# EAGLE design LOCO-WIFI (EAGLE 9.5.2)
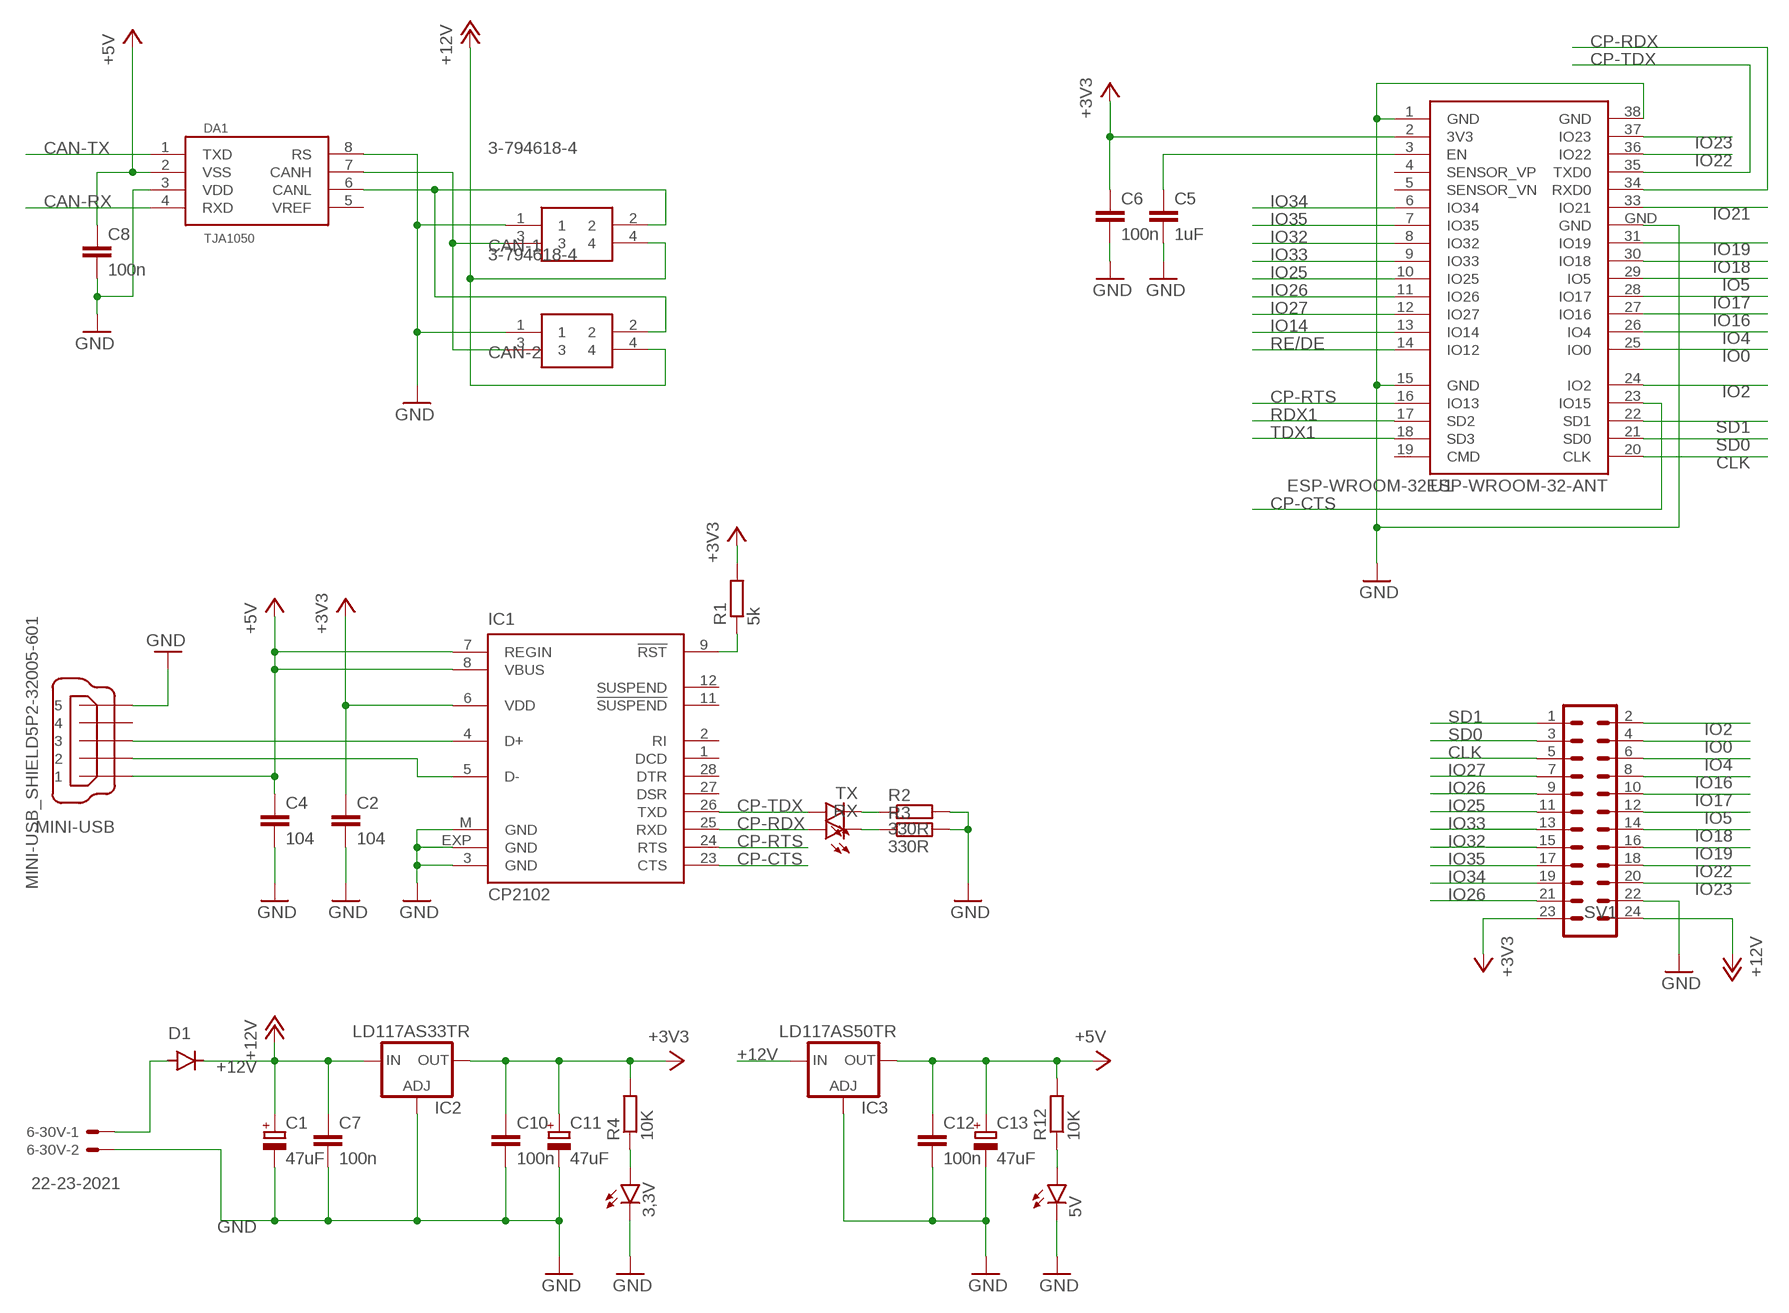
[diagram p0: schematic, sheet 1]

## Parts
3,3V  LEDCHIPLED_0603  [CHIPLED_0603]
5V  LEDCHIPLED_0603  [CHIPLED_0603]
6-30V  22-23-2021  [22-23-2021]
C1  47uF  CPOL-EUB/3528-21R  [B/3528-21R]
C2  104  C-EUC0402  [C0402]
C4  104  C-EUC0402  [C0402]
C5  1uF  C-EUC0402  [C0402]
C6  100n  C-EUC0402  [C0402]
C7  100n  C-EUC0402  [C0402]
C8  100n  C-EUC0402  [C0402]
C10  100n  C-EUC0402  [C0402]
C11  47uF  CPOL-EUB/3528-21R  [B/3528-21R]
C12  100n  C-EUC0402  [C0402]
C13  47uF  CPOL-EUB/3528-21R  [B/3528-21R]
CAN-1  3-794618-4  [SHDRRA4W102P300_2X2_686X892X73]
CAN-2  3-794618-4  [SHDRRA4W102P300_2X2_686X892X73]
D1  DIODE-DO-214AC  [DO-214AC]
DA1  TJA1050  [SO08]
IC1  CP2102  [MLP28]
IC2  LD117AS33TR  [SOT223]
IC3  LD117AS50TR  [SOT223]
MINI-USB  MINI-USB_SHIELD5P2-32005-601  [32005-601]
R1  5k  R-EU_R0603  [R0603]
R2  330R  R-EU_R0603  [R0603]
R3  330R  R-EU_R0603  [R0603]
R4  10K  R-EU_R0603  [R0603]
R12  10K  R-EU_R0603  [R0603]
RX  LEDCHIPLED_0603  [CHIPLED_0603]
SV1  MA12-2  [MA12-2]
TX  LEDCHIPLED_0603  [CHIPLED_0603]
U1  ESP-WROOM-32ESP-WROOM-32-ANT  [ESP-WROOM-32-ANT]

## Nets
+3V3: C2.1 C6.1 C10.1 C11.+ IC1.6(VDD) IC2.4(OUT) R1.2 R4.2 SV1.23 U1.2(3V3)
+5V: C4.1 C8.1 C12.1 C13.+ DA1.2(VSS) IC1.7(REGIN) IC1.8(VBUS) IC3.4(OUT) MINI-USB.1 R12.2
+12V: C1.+ C7.1 CAN-1.4 CAN-2.4 D1.C IC2.3(IN) IC3.3(IN) SV1.24
CAN-RX: DA1.4(RXD)
CAN-TX: DA1.1(TXD)
CLK: SV1.5 U1.20(CLK)
CP-CTS: IC1.23(CTS) U1.23(IO15)
CP-RDX: IC1.25(RXD) RX.A U1.34(RXD0)
CP-RTS: IC1.24(RTS) U1.16(IO13)
CP-TDX: IC1.26(TXD) TX.A U1.35(TXD0)
GND: 3,3V.C 5V.C 6-30V.2 C1.- C2.2 C4.2 C5.2 C6.2 C7.2 C8.2 C10.2 C11.- C12.2 C13.- CAN-1.1 CAN-2.1 DA1.3(VDD) DA1.8(RS) IC1.3(GND) IC1.EXP(GND) IC1.M(GND) IC2.1(ADJ) IC3.1(ADJ) MINI-USB.5 R2.2 R3.2 SV1.22 U1.1(GND) U1.15(GND) U1.38(GND) U1.GND
IO0: SV1.4 U1.25(IO0)
IO2: SV1.2 U1.24(IO2)
IO4: SV1.6 U1.26(IO4)
IO5: SV1.12 U1.29(IO5)
IO14: U1.13(IO14)
IO16: SV1.8 U1.27(IO16)
IO17: SV1.10 U1.28(IO17)
IO18: SV1.14 U1.30(IO18)
IO19: SV1.16 U1.31(IO19)
IO21: U1.33(IO21)
IO22: SV1.18 U1.36(IO22)
IO23: SV1.20 U1.37(IO23)
IO25: SV1.11 U1.10(IO25)
IO26: SV1.9 SV1.21 U1.11(IO26)
IO27: SV1.7 U1.12(IO27)
IO32: SV1.15 U1.8(IO32)
IO33: SV1.13 U1.9(IO33)
IO34: SV1.19 U1.6(IO34)
IO35: SV1.17 U1.7(IO35)
N$1: IC1.5(D-) MINI-USB.2
N$2: IC1.4(D+) MINI-USB.3
N$3: IC1.9(!RST) R1.1
N$4: 6-30V.1 D1.A
N$5: R2.1 TX.C
N$6: 3,3V.A R4.1
N$7: R3.1 RX.C
N$8: CAN-1.3 CAN-2.3 DA1.7(CANH)
N$9: CAN-1.2 CAN-2.2 DA1.6(CANL)
N$13: 5V.A R12.1
RDX1: U1.17(SD2)
RE/DE: U1.14(IO12)
RESET: C5.1 U1.3(EN)
SD0: SV1.3 U1.21(SD0)
SD1: SV1.1 U1.22(SD1)
TDX1: U1.18(SD3)
Unconnected: DA1.5(VREF) IC1.1(DCD) IC1.2(RI) IC1.11(!SUSPEND) IC1.12(SUSPEND) IC1.27(DSR) IC1.28(DTR) MINI-USB.4 MINI-USB.M1(S1) MINI-USB.M2(S2) U1.4(SENSOR_VP) U1.5(SENSOR_VN) U1.19(CMD)

## Library data of the parts
3,3V 5V RX TX = led:LED: LED OSRAM: - CHIPLED LG R971, LG N971, LY N971, LG Q971, LY Q971, LO R971, LY R971 LH N974, LH R974 LS Q976, LO Q976, LY Q976 LO Q996 - Hyper CHIPLED LW Q18S LB Q993, LB Q99A, LB R99A - SideLED LS A670, LO A670, LY A670, LG A670, LP A670 LB A673, LV A673, LT A673, LW A673 LH A674 LY A675 LS A676, LA A676, LO A676, LY A676, LW A676 LS A679, LY A679, LG A679 - Hyper Micro SIDELED® LS Y876, LA Y876, LO Y876, LY Y876 LT Y87S - SmartLED LW L88C, LW L88S LB L89C, LB L89S, LG L890 LS L89K, LO L89K, LY L89K LS L896, LA L896, LO L896, LY L896 - TOPLED LS T670, LO T670, LY T670, LG T670, LP T670 LSG T670, LSP T670, LSY T670, LOP T670, LYG T670 LG T671, LOG T671, LSG T671 LB T673, LV T673, LT T673, LW T673 LH T674 LS T676, LA T676, LO T676, LY T676, LB T676, LH T676, LSB T676, LW T676 LB T67C, LV T67C, LT T67C, LS T67K, LO T67K, LY T67K, LW E67C LS E67B, LA E67B, LO E67B, LY E67B, LB E67C, LV E67C, LT E67C LW T67C LS T679, LY T679, LG T679 LS T770, LO T770, LY T770, LG T770, LP T770 LB T773, LV T773, LT T773, LW T773 LH T774 LS E675, LA E675, LY E675, LS T675 LS T776, LA T776, LO T776, LY T776, LB T776 LHGB T686 LT T68C, LB T68C - Hyper Mini TOPLED® LB M676 - Mini TOPLED Santana® LG M470 LS M47K, LO M47K, LY M47K Source: http://www.osram.convergy.de LUXEON: - LUMILED® LXK2-PW12-R00, LXK2-PW12-S00, LXK2-PW14-U00, LXK2-PW14-V00 LXK2-PM12-R00, LXK2-PM12-S00, LXK2-PM14-U00 LXK2-PE12-Q00, LXK2-PE12-R00, LXK2-PE12-S00, LXK2-PE14-T00, LXK2-PE14-U00 LXK2-PB12-K00, LXK2-PB12-L00, LXK2-PB12-M00, LXK2-PB14-N00, LXK2-PB14-P00, LXK2-PB14-Q00 LXK2-PR12-L00, LXK2-PR12-M00, LXK2-PR14-Q00, LXK2-PR14-R00 LXK2-PD12-Q00, LXK2-PD12-R00, LXK2-PD12-S00 LXK2-PH12-R00, LXK2-PH12-S00 LXK2-PL12-P00, LXK2-PL12-Q00, LXK2-PL12-R00 Source: www.luxeon.com KINGBRIGHT: KA-3528ASYC Source: www.kingbright.com
6-30V = con-molex:22-23-2021: .100" (2.54mm) Center Header - 2 Pin; MF: MOLEX; MPN: 22-23-2021; OC_FARNELL: 1462926; OC_NEWARK: 25C3832
C1 C11 C13 = rcl:CPOL-EU: POLARIZED CAPACITOR, European symbol; SPICEPREFIX: C
C2 C4-C8 C10 C12 = rcl:C-EU: CAPACITOR, European symbol; SPICEPREFIX: C
CAN-1 CAN-2 = SamacSys_Parts:3-794618-4: 4 way 2 row r/a header Mate-N-Lok Source: Datasheet <https://rs.componentsearchengine.com/Datasheets/2/3-794618-4.pdf>; DESCRIPTION: 4 way 2 row r/a header Mate-N-Lok; HEIGHT: 7.37mm; MANUFACTURER_NAME: TE Connectivity; MANUFACTURER_PART_NUMBER: 3-794618-4
D1 = diode:DIODE-: DIODE
DA1 = TJA1050:TJA1050: High speed CAN transceiver Input levels compatible with 3.3 V and 5 V devices 5V supply
IC1 = silabs:CP210*: Single-Chip USB to UART Bridge Source: www.silabs.com .. CP2101.pdf / cp2102.pdf; MF: FARNELL; MPN: CP2102-GM; OC_FARNELL: 9282130; OC_NEWARK: 30K5635
IC2 IC3 = v-reg:LD117A?*: Low drop fixed and adjustable positive voltage regulators 1 A Source: http://www.st.com/stonline/products/literature/ds/7194/ld1117axx.pdf
MINI-USB = con-cypressindustries:MINI-USB_SHIELD5P2-: MINI USB-B R/A DIP 5pol. Source: www.cypressindustries.com; OC_FARNELL: unknown; OC_NEWARK: unknown
R1-R4 R12 = rcl:R-EU_: RESISTOR, European symbol; SPICEPREFIX: R
SV1 = con-lstb:MA12-2: PIN HEADER; OC_FARNELL: unknown; OC_NEWARK: unknown
U1 = esp32:ESP-WROOM-32: Espressif Systems ESP-WROOM-32

## Board
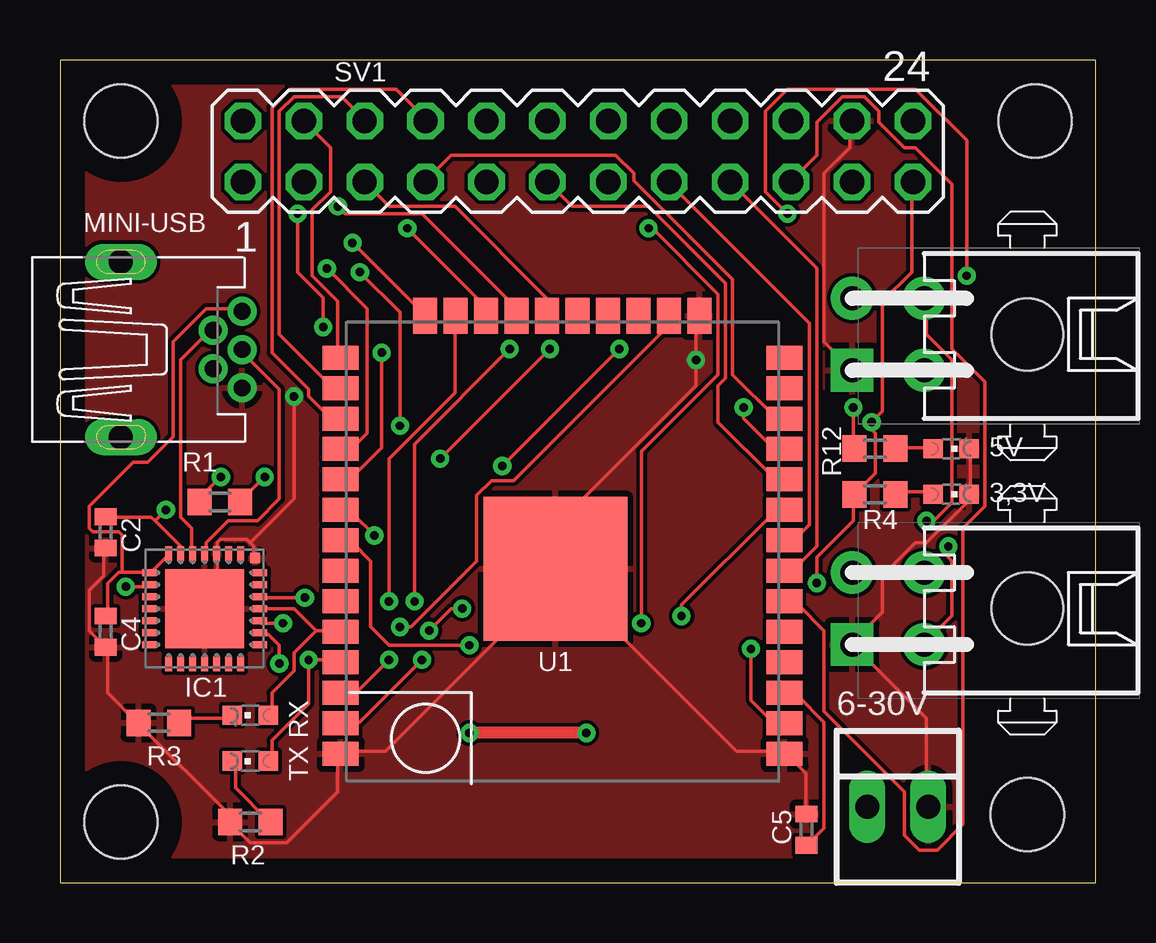
[diagram p1: board, top side]
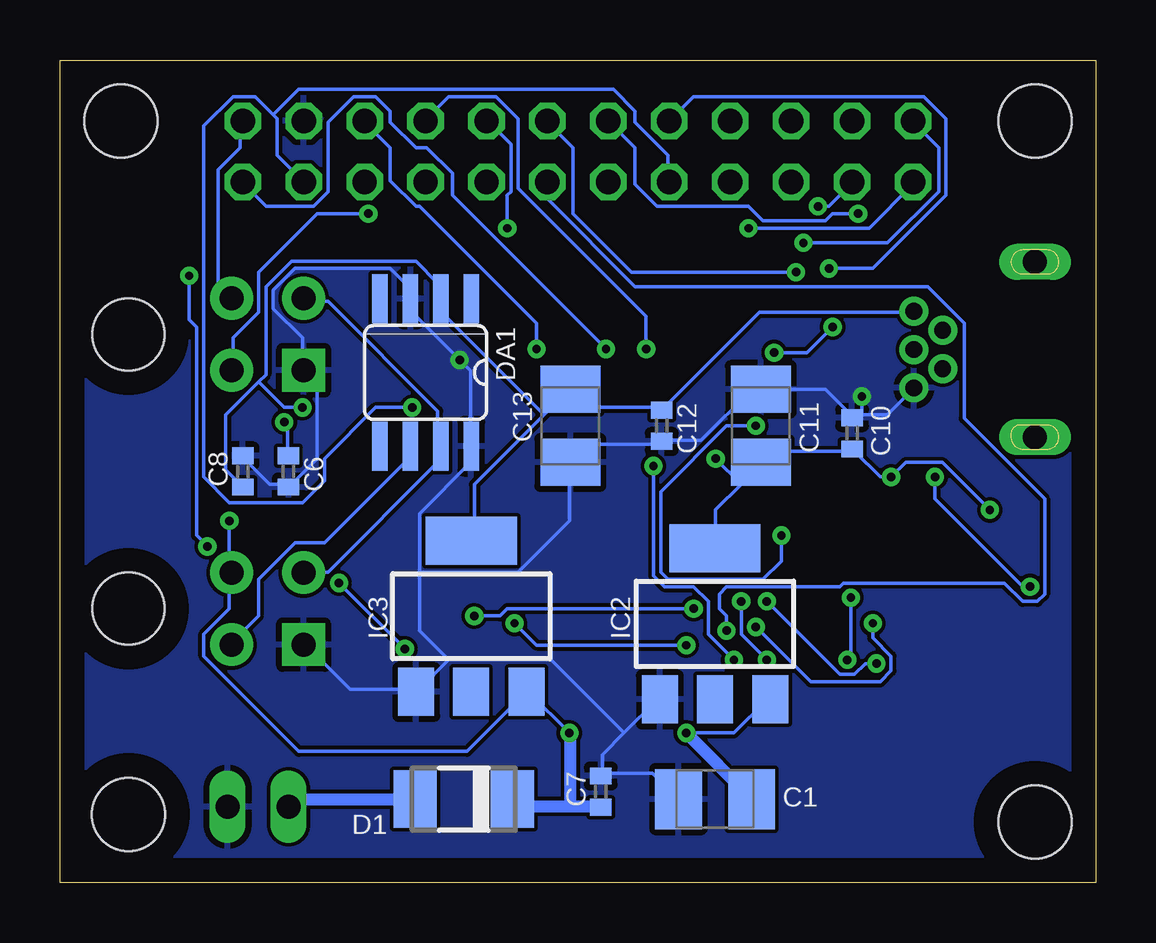
[diagram p2: board, bottom side, seen from below]

Size 43.18 x 34.29 mm. Coordinates in mm from the lower left corner, seen from the top.
Outline: 0,0 43.18,0 43.18,34.29 0,34.29 0,0
Copper layers (1*16): Top 0.035mm / dielectric 1.5mm / Bottom 0.035mm
Design rules "default": minimum track width 6mil, minimum drill 0.35mm, track to track 6mil, track to pad 6mil, pad to pad 6mil, via to via 6mil, smd to smd 6mil, copper to edge 40mil, drill to drill 6mil, minimum pad ring 10mil, minimum via ring 8mil, stop-mask expansion 4mil, vias tented up to drill 0mil, thermal gap 10mil
Holes 3.05 mm at 2.54,2.54 2.54,31.75 40.64,31.75 40.32,2.86

### Footprints (pad centres in the part's own frame; a part is rotated, then mirrored left to right if it is on the bottom)
CHIPLED_0603 = smd 0.8 x 0.8: A 0,-0.75; C 0,0.75
22-23-2021 = drill 1 long: 1 -1.27,0; 2 1.27,0
B/3528-21R = smd 1.95 x 2.5: + 1.525,0; - -1.525,0
C0402 = smd 0.7 x 0.9: 1 -0.65,0; 2 0.65,0
SHDRRA4W102P300_2X2_686X892X73 = drill 1 pad 1.778 square: 1 1.5,-7.3 | drill 1 pad 1.778: 2 1.5,-4.3; 3 -1.5,-7.3; 4 -1.5,-4.3 | hole 3: 0,0
DO-214AC = smd 1.8 x 2.4: A 2.025,0; C -2.025,0
SO08 = smd 0.66 x 2.032: 1 -1.905,-3.073; 2 -0.635,-3.073; 3 0.635,-3.073; 4 1.905,-3.073; 5 1.905,3.073; 6 0.635,3.073; 7 -0.635,3.073; 8 -1.905,3.073
MLP28 = smd 0.6 x 0.3: 1 -2.3,1.5; 2 -2.3,1; 3 -2.3,0.5; 4 -2.3,0; 5 -2.3,-0.5; 6 -2.3,-1; 7 -2.3,-1.5; 15 2.3,-1.5; 16 2.3,-1; 17 2.3,-0.5; 18 2.3,0; 19 2.3,0.5; 20 2.3,1; 21 2.3,1.5 | smd 0.3 x 0.6: 8 -1.5,-2.3; 9 -1,-2.3; 10 -0.5,-2.3; 11 0,-2.3; 12 0.5,-2.3; 13 1,-2.3; 14 1.5,-2.3; 22 1.5,2.3; 23 1,2.3; 24 0.5,2.3; 25 0,2.3; 26 -0.5,2.3; 27 -1,2.3; 28 -1.5,2.3 | smd 3.3 x 3.3: EXP 0,0 | smd 0.435 x 0.435: M -2.103,2.103
SOT223 = smd 1.5 x 2: 1 -2.3,-3.15; 2 0,-3.15; 3 2.3,-3.15 | smd 3.8 x 2: 4 0,3.15
32005-601 = drill 0.7 pad 1.016: 1 2.825,1.6; 2 1.625,0.8; 3 2.825,0; 4 1.625,-0.8; 5 2.825,-1.6 | drill 1 pad 1.422 long: M1 -2.225,3.65; M2 -2.225,-3.65
R0603 = smd 1 x 1.1: 1 -0.85,0; 2 0.85,0
MA12-2 = drill 1.016 octagon: 1 -13.97,-1.27; 2 -13.97,1.27; 3 -11.43,-1.27; 4 -11.43,1.27; 5 -8.89,-1.27; 6 -8.89,1.27; 7 -6.35,-1.27; 8 -6.35,1.27; 9 -3.81,-1.27; 10 -3.81,1.27; 11 -1.27,-1.27; 12 -1.27,1.27; 13 1.27,-1.27; 14 1.27,1.27; 15 3.81,-1.27; 16 3.81,1.27; 17 6.35,-1.27; 18 6.35,1.27; 19 8.89,-1.27; 20 8.89,1.27; 21 11.43,-1.27; 22 11.43,1.27; 23 13.97,-1.27; 24 13.97,1.27
ESP-WROOM-32-ANT = smd 1.5 x 1: 1 -9.25,7; 2 -9.25,5.73; 3 -9.25,4.46; 4 -9.25,3.19; 5 -9.25,1.92; 6 -9.25,0.65; 7 -9.25,-0.62; 8 -9.25,-1.89; 9 -9.25,-3.16; 10 -9.25,-4.43; 11 -9.25,-5.7; 12 -9.25,-6.97; 13 -9.25,-8.24; 14 -9.25,-9.51; 25 9.25,-9.51; 26 9.25,-8.24; 27 9.25,-6.97; 28 9.25,-5.7; 29 9.25,-4.43; 30 9.25,-3.16; 31 9.25,-1.89; 32 9.25,-0.62; 33 9.25,0.65; 34 9.25,1.92; 35 9.25,3.19; 36 9.25,4.46; 37 9.25,5.73; 38 9.25,7 | smd 1 x 1.5: 15 -5.7,-11.25; 16 -4.43,-11.25; 17 -3.16,-11.25; 18 -1.89,-11.25; 19 -0.62,-11.25; 20 0.65,-11.25; 21 1.92,-11.25; 22 3.19,-11.25; 23 4.46,-11.25; 24 5.73,-11.25 | smd 6 x 6: GND 0.3,-0.7

### Placement (x,y rotation side)
3,3V  37.15,16.19 270 top
5V  37.15,18.1 270 top
6-30V  34.92,3.17 0 top
C1  15.88,3.49 0 bottom
C2  1.91,14.61 270 top
C4  1.91,10.48 270 top
C5  31.11,2.22 90 top
C6  33.66,17.14 270 bottom
C7  20.64,3.81 90 bottom
C8  35.56,17.14 90 bottom
C10  10.16,18.73 90 bottom
C11  13.97,19.05 270 bottom
C12  18.1,19.05 270 bottom
C13  21.91,19.05 90 bottom
CAN-1  40.32,11.43 270 top
CAN-2  40.32,22.86 270 top
D1  26.35,3.49 180 bottom
DA1  27.94,21.27 180 bottom
IC1  6.03,11.43 270 top
IC2  15.88,10.79 0 bottom
IC3  26.04,11.11 0 bottom
MINI-USB  4.76,22.23 0 top
R1  6.67,15.88 0 top
R2  7.94,2.54 180 top
R3  4.13,6.67 180 top
R4  33.97,16.19 180 top
R12  33.97,18.1 180 top
RX  7.94,6.99 90 top
SV1  21.59,30.48 0 top
TX  7.94,5.08 90 top
U1  20.95,12.38 180 top

### Tracks (layer width: path | path; a pad name or v marks a point on that pad's centre or on a via)
+3V3  (via drill 0.35)
  Top 0.152: 3.96,15.09 3.81,15.24 1.98,15.24 C2.1 | 3.96,15.09 5.03,14.02 5.03,13.87 IC1.6 | v8.53,16.92 7.62,16 R1.2 | v4.42,15.54 3.96,15.09 | v28.8,9.75 28.8,7.62 29.72,6.71 30.18,6.71 U1.2 | v31.55,12.5 31.55,13.56 33.07,15.09 33.07,16.15 R4.2 33.22,16.31 33.98,17.07 33.98,18.75 33.83,18.9 v33.83,19.2 34.29,19.66 34.29,24.23 35.51,25.45 35.51,29.11 SV1.23 | v20.42,22.25 v15.85,17.68
  Bottom 0.152: C11.+ 13.87,17.53 13.41,17.98 10.21,17.98 C10.1 10.06,17.98 8.99,16.92 v8.53,16.92 7.92,17.53 6.4,17.53 v4.42,15.54 | 14.78,16.61 14.02,17.37 C11.+ | 14.78,16.61 15.85,15.54 15.85,14.02 IC2.4 | v33.83,19.2 33.68,19.05 33.68,17.83 C6.1 | v31.55,12.5 v28.8,9.75 | v15.85,17.68 14.78,16.61 | v20.42,22.25 26.82,28.65 26.82,29.57 27.89,30.63 28.35,30.63 29.41,31.7 29.41,32.16 30.02,32.77 30.94,32.77 32,31.7 32,28.8 32.61,28.19 34.59,28.19 35.51,29.11 SV1.23 | 14.78,16.61 C11.+
+5V  (via drill 0.35)
  Top 0.152: v33.07,19.81 33.07,18.14 R12.2 | IC1.7 4.57,13.72 3.81,12.95 IC1.8 3.66,12.95 2.59,12.95 | 2.59,12.95 2.44,12.95 1.98,12.5 1.98,11.28 C4.1 | 2.59,12.95 2.59,14.48 2.44,14.63 1.37,14.63 1.22,14.78 1.22,15.7 3.05,17.53 3.66,17.53 4.72,18.59 4.72,22.55 6.1,23.93 7.47,23.93 MINI-USB.1
  Bottom 0.152: 34.9,20.88 34.59,21.18 34.59,24.84 33.53,25.91 28.35,25.91 27.43,24.99 27.43,24.38 DA1.2 27.28,24.23 27.28,23.77 23.01,19.51 | 34.9,20.88 36.27,19.51 36.27,17.22 35.66,16.61 C8.1 | v33.07,19.81 33.83,19.81 34.9,20.88 | MINI-USB.1 7.62,23.77 14.02,23.77 17.98,19.81 C12.1 18.14,19.81 21.03,19.81 21.79,20.57 C13.+ 21.95,20.57 23.01,19.51 | 23.01,19.51 25.91,16.61 25.91,14.33 IC3.4
+12V  (via drill 0.35)
  Top 0.152: v36.12,15.09 36.42,15.09 37.19,15.85 37.19,21.79 36.12,22.86 36.12,24.23 CAN-2.4
  Top 0.508: v21.95,6.25 v17.07,6.25
  Bottom 0.152: SV1.24 35.66,31.7 35.66,30.63 36.58,29.72 36.58,24.84 36.12,24.38 CAN-2.4 | v17.07,6.25 15.09,6.25 13.72,7.62 IC2.3 | v36.12,15.09 36.12,12.95 CAN-1.4 36.12,12.8 36.12,11.43 37.19,10.36 37.19,9.45 33.22,5.49 26.21,5.49 23.77,7.92 IC3.3 23.62,7.92 v21.95,6.25 21.91,6.21 | C1.+ 14.35,3.53
  Bottom 0.508: 14.35,3.53 v17.07,6.25 | C7.1 20.68,3.2 21.91,3.2 | D1.C 24.03,3.2 21.91,3.2 | 21.91,3.2 21.91,6.21
CLK
  Top 0.152: SV1.5 13.72,28.19 16.46,28.19 20.27,24.38 20.27,23.77 U1.20
CP-CTS  (via drill 0.35)
  Top 0.152: v9.14,9.14 9.14,9.91 8.69,10.36 8.38,10.36 IC1.23 | v13.72,11.73 13.72,17.68 16.46,20.42 16.46,23.62 U1.23
  Bottom 0.152: v9.14,9.14 9.6,9.14 10.06,8.69 10.67,8.69 v13.72,11.73
CP-RDX
  Top 0.152: IC1.25 9.75,11.43 10.67,10.52 | 10.67,10.52 11.58,10.52 U1.34 | 10.67,10.52 9.75,9.6 9.75,8.84 8.84,7.92 8.84,7.01 RX.A
CP-RTS  (via drill 0.35)
  Top 0.152: v9.3,10.82 8.38,10.82 IC1.24 | v14.17,10.67 14.63,10.67 17.37,13.41 17.37,16.15 17.98,16.76 18.9,16.76 25.3,23.16 25.3,23.62 U1.16
  Bottom 0.152: v9.3,10.82 9.3,10.21 8.53,9.45 8.53,8.84 8.99,8.38 11.89,8.38 v14.17,10.67
CP-TDX  (via drill 0.35)
  Top 0.152: v10.21,11.89 8.38,11.89 IC1.26 | U1.35 11.58,9.3 v10.36,9.3 10.36,7.47 8.84,5.94 8.84,5.18 TX.A
  Bottom 0.152: v10.21,11.89 10.21,9.45 v10.36,9.3
GND  (via drill 0.35)
  Top 0.152: C2.2 1.83,13.87 1.83,12.8 1.22,12.19 1.22,10.52 1.83,9.91 C4.2 1.98,9.75 1.98,7.92 3.2,6.71 R3.2 3.35,6.55 7.01,2.9 7.01,2.59 R2.2 7.16,2.44 7.92,1.68 9.45,1.68 11.58,3.81 11.58,5.33 U1.38 11.73,5.49 13.56,5.49 20.88,12.8 | C5.2 31.09,2.9 31.09,4.57 30.33,5.33 U1.1 30.18,5.49 28.19,5.49 20.88,12.8 | U1.15 26.52,23.62 v26.52,21.79 26.52,20.73 20.73,14.94 20.73,13.11 U1.GND | 20.88,12.8 20.73,12.95 U1.GND | 20.88,12.8 U1.GND | 7.92,14.17 7.77,14.33 6.71,14.33 6.55,14.17 6.55,13.87 IC1.3 6.55,13.72 6.55,11.89 6.1,11.43 IC1.EXP | 7.92,14.17 8.08,14.02 8.08,13.56 IC1.M | 7.92,14.17 9.75,16 v9.75,20.27 | SV1.22 32.92,31.7 32.92,30.63 31.85,29.57 31.85,22.55 32.92,21.49 CAN-2.1 | 5V.C 37.95,17.98 37.95,16.31 3,3V.C 37.8,16.15 37.8,15.85 36.12,14.17 35.66,14.17 34.29,12.8 34.29,11.28 33.07,10.06 CAN-1.1 33.07,9.91 36.12,6.86 36.12,3.2 6-30V.2
  Bottom 0.152: 9.75,19.51 8.69,19.51 7.62,20.57 MINI-USB.5 | 9.75,19.51 10.06,19.51 C10.2 | C10.2 10.21,19.51 11.28,20.57 13.87,20.57 C11.- 14.02,20.57 14.33,20.57 16.46,18.44 17.98,18.44 C12.2 18.14,18.29 21.03,18.29 21.79,17.53 C13.- 21.95,17.37 21.95,15.09 24.08,12.95 28.19,12.95 | 9.75,19.51 v9.75,20.27 | 9.75,19.51 C10.2 | C8.2 35.51,17.68 34.44,16.61 33.68,16.61 C6.2 33.53,16.61 32.46,17.68 32.46,20.88 32.92,21.34 CAN-2.1 33.07,21.49 33.07,22.71 34.29,23.93 34.29,24.69 33.38,25.6 29.41,25.6 28.65,24.84 28.65,24.38 DA1.3 28.5,24.23 28.5,23.77 v26.52,21.79 26.06,21.34 26.06,18.29 DA1.8 26.06,18.14 26.06,17.53 28.19,15.39 28.19,12.95 | 20.57,4.57 20.57,5.33 19.66,6.25 | 19.66,6.25 18.29,7.62 IC2.1 | 20.57,4.57 C7.2 | CAN-1.1 32.92,9.91 31.09,8.08 28.35,8.08 IC3.1 28.19,8.08 26.98,9.3 | 19.66,6.25 22.71,9.3 26.98,9.3 | 28.19,12.95 28.19,10.52 26.98,9.3 | C1.- 18.48,4.57 20.57,4.57
  pour Top: 0,34.29 43.18,34.29 43.18,0 0,0
  pour Bottom: 43.18,34.29 0,34.29 0,0 43.18,0
IO0
  Top 0.152: SV1.4 11.28,30.63 11.28,28.8 10.52,28.04 10.52,25.3 11.58,24.23 11.58,21.95 U1.25
IO2  (via drill 0.35)
  Top 0.152: v12.19,26.67 15.09,23.77 U1.24
  Bottom 0.152: v12.19,26.67 8.69,26.67 6.55,28.8 6.55,30.63 7.62,31.7 SV1.2
IO4
  Top 0.152: U1.26 11.58,20.73 11.28,20.73 9.14,22.86 9.14,32.16 9.75,32.77 11.73,32.77 12.65,31.85 SV1.6
IO5  (via drill 0.35)
  Top 0.152: v13.41,22.1 13.41,18.14 12.19,16.92 11.73,16.92 U1.29 | v10.97,23.16 10.97,24.38 9.91,25.45 v9.91,27.89
  Bottom 0.152: v13.41,22.1 12.04,22.1 v10.97,23.16 | v9.91,27.89 10.97,27.89 11.28,27.58 13.87,27.58 14.48,28.19 18.29,28.19 19.2,29.11 19.2,30.63 SV1.12
IO16
  Top 0.152: U1.27 11.58,19.36 11.28,19.36 10.36,20.27 10.36,20.57 8.84,22.1 8.84,32.31 9.6,33.07 14.02,33.07 15.24,31.85 SV1.8
IO17  (via drill 0.35)
  Top 0.152: v11.12,25.6 12.8,23.93 12.8,18.75 12.19,18.14 11.73,18.14 U1.28
  Bottom 0.152: v11.12,25.6 9.3,25.6 6.25,28.65 6.25,31.85 7.16,32.77 16.76,32.77 SV1.10
IO18  (via drill 0.35)
  Top 0.152: v13.11,14.48 12.19,15.39 11.73,15.39 U1.30 | v14.17,19.05 14.17,23.77 v12.5,25.45
  Bottom 0.152: v13.11,14.48 13.11,13.41 13.87,12.65 17.83,12.65 18.14,12.95 18.14,16.31 15.39,19.05 v14.17,19.05 | v12.5,25.45 19.36,25.45 21.79,27.89 21.79,30.63 22.86,31.7 SV1.14
IO19  (via drill 0.35)
  Top 0.152: v17.07,9.91 13.72,9.91 12.95,10.67 12.95,13.41 12.19,14.17 11.73,14.17 U1.31 | v24.23,10.82 24.23,17.98 27.43,21.18 27.43,24.54 24.69,27.28 v24.54,27.28
  Bottom 0.152: v17.07,9.91 23.32,9.91 v24.23,10.82 | v24.54,27.28 24.54,28.65 24.38,28.8 24.38,30.79 25.3,31.7 SV1.16
IO22  (via drill 0.35)
  Top 0.152: v13.72,9.3 12.34,7.92 11.73,7.92 U1.36 | v14.78,11.73 14.78,18.29 v18.75,22.25
  Bottom 0.152: v13.72,9.3 14.78,10.36 v14.78,11.73 | v18.75,22.25 18.75,23.62 24.08,28.96 24.08,31.85 24.99,32.77 26.98,32.77 27.89,31.85 SV1.18
IO23  (via drill 0.35)
  Top 0.152: v15.09,9.3 12.5,6.71 11.73,6.71 U1.37 | v23.32,22.25 v18.44,17.37
  Bottom 0.152: v15.09,9.3 16.15,10.36 16.15,11.73 16.76,12.34 17.98,12.34 18.44,12.8 v18.44,17.37 | v23.32,22.25 23.32,23.32 28.19,28.19 28.35,28.19 29.41,29.26 29.41,30.63 30.48,31.7 SV1.20
IO25
  Top 0.152: SV1.11 21.34,28.19 24.54,28.19 27.74,24.99 27.74,21.03 27.43,20.73 27.43,19.2 29.72,16.92 30.18,16.92 U1.10
IO26  (via drill 0.35)
  Top 0.152: v28.5,19.81 28.5,19.36 29.72,18.14 30.18,18.14 U1.11
  Bottom 0.152: v28.5,19.81 30.02,19.81 32.16,17.68 32.16,16.76 33.07,15.85 36.12,15.85 37.19,16.92 37.19,31.55 35.97,32.77 35.05,32.77 34.29,32 | 34.29,32 34.14,31.85 34.14,30.33 SV1.21 | 34.29,32 33.22,33.07 20.12,33.07 19.2,32.16 19.2,31.7 17.83,30.33 17.83,29.26 SV1.9
IO27
  Top 0.152: U1.12 30.18,19.36 29.87,19.36 28.04,21.18 28.04,25.15 23.93,29.26 23.93,29.57 23.16,30.33 16.31,30.33 15.24,29.26 SV1.7
IO32
  Top 0.152: U1.8 30.33,14.33 30.63,14.33 31.24,14.94 31.24,23.32 25.45,29.11 SV1.15
IO33  (via drill 0.35)
  Top 0.152: v25.91,11.12 25.91,11.58 29.72,15.39 30.18,15.39 U1.9 | v16.76,11.43 16.31,11.43 v15.39,10.52
  Bottom 0.152: v25.91,11.12 24.84,11.12 24.54,11.43 v16.76,11.43 | v15.39,10.52 15.39,11.12 15.7,11.43 15.7,12.04 15.39,12.34 10.67,12.34 10.52,12.5 3.81,12.5 3.05,11.73 2.44,11.73 2.13,12.04 2.13,16 5.49,19.36 5.49,23.32 7.01,24.84 19.2,24.84 22.86,28.5 SV1.13
IO34
  Top 0.152: U1.6 30.33,11.58 30.79,11.58 31.85,10.52 31.85,7.16 35.2,3.81 35.2,1.98 35.81,1.37 36.58,1.37 37.64,2.44 37.64,14.78 38.56,15.7 38.56,20.88 37.19,22.25 37.19,29.11 35.66,30.63 35.2,30.63 34.14,31.7 34.14,32.16 33.53,32.77 32.61,32.77 31.55,31.7 31.55,30.33 30.48,29.26 SV1.19
IO35
  Top 0.152: SV1.17 31.55,25.6 31.55,14.02 30.63,13.11 30.33,13.11 U1.7
N$1
  Top 0.152: IC1.5 5.49,13.87 5.49,14.78 5.03,15.24 5.03,21.79 6.25,23.01 MINI-USB.2
N$2
  Top 0.152: IC1.4 6.1,13.87 6.1,14.17 7.01,15.09 8.23,15.09 9.14,16 9.14,20.57 7.62,22.1 MINI-USB.3
N$3  (via drill 0.35)
  Top 0.152: v2.74,12.34 3.66,12.34 IC1.9 | v6.71,16.92 5.79,16 R1.1
  Bottom 0.152: v2.74,12.34 3.05,12.34 6.71,16 v6.71,16.92
N$4
  Bottom 0.508: D1.A 33.34,3.49 6-30V.1
N$5
  Top 0.152: TX.C 7.32,5.03 7.32,3.96 8.69,2.59 R2.1
N$6
  Top 0.152: 3,3V.A 36.27,16.31 34.9,16.31 R4.1
N$7
  Top 0.152: RX.C 7.16,6.86 5.18,6.86 5.03,6.71 R3.1
N$8
  Bottom 0.152: CAN-1.3 32.92,12.95 32,12.95 27.43,17.53 27.43,18.14 DA1.7 27.43,18.29 27.43,19.66 32,24.23 32.92,24.23 CAN-2.3
N$9  (via drill 0.35)
  Top 0.152: v30.33,27.89 29.41,28.8 29.41,32.16 30.33,33.07 35.66,33.07 37.8,30.94 v37.8,25.3 | v37.03,14.02 37.03,13.56 37.19,13.41 37.19,11.12 36.12,10.06 CAN-1.2
  Bottom 0.152: DA1.6 28.65,18.14 28.65,17.68 32.16,14.17 33.38,14.17 34.9,12.65 34.9,11.12 35.97,10.06 CAN-1.2 | v30.33,27.89 32.46,27.89 34.9,25.45 34.9,23.77 35.97,22.71 35.97,21.49 CAN-2.2 | v37.8,25.3 37.8,23.47 37.49,23.16 37.49,14.48 v37.03,14.02
N$13
  Top 0.152: 5V.A 36.27,18.14 34.9,18.14 R12.1
RESET
  Top 0.152: C5.1 31.24,1.68 31.85,2.29 31.85,6.71 30.79,7.77 30.33,7.77 U1.3
SD0  (via drill 0.35)
  Top 0.152: v11.58,28.19 11.89,27.89 15.09,27.89 18.9,24.08 18.9,23.77 U1.21
  Bottom 0.152: v11.58,28.19 11.12,28.19 10.21,29.11 SV1.3
SD1  (via drill 0.35)
  Top 0.152: v14.48,27.28 17.68,24.08 17.68,23.77 U1.22
  Bottom 0.152: v14.48,27.28 9.45,27.28 7.62,29.11 SV1.1